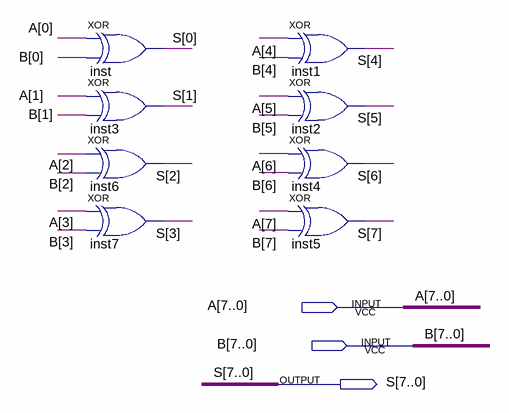
[diagram p0: schematic sheet]
// Quartus schematic XOR8BIT.bdf as structural Verilog: 8 symbols, 3 pins
module XOR8BIT (
  input  [7:0] A,
  input  [7:0] B,
  output [7:0] S
);

  xor inst (S[0], A[0], B[0]);
  xor inst3 (S[1], A[1], B[1]);
  xor inst6 (S[2], A[2], B[2]);
  xor inst7 (S[3], A[3], B[3]);
  xor inst1 (S[4], A[4], B[4]);
  xor inst2 (S[5], A[5], B[5]);
  xor inst4 (S[6], A[6], B[6]);
  xor inst5 (S[7], A[7], B[7]);
endmodule
